# EAGLE design untitled (EAGLE 7.1.0)
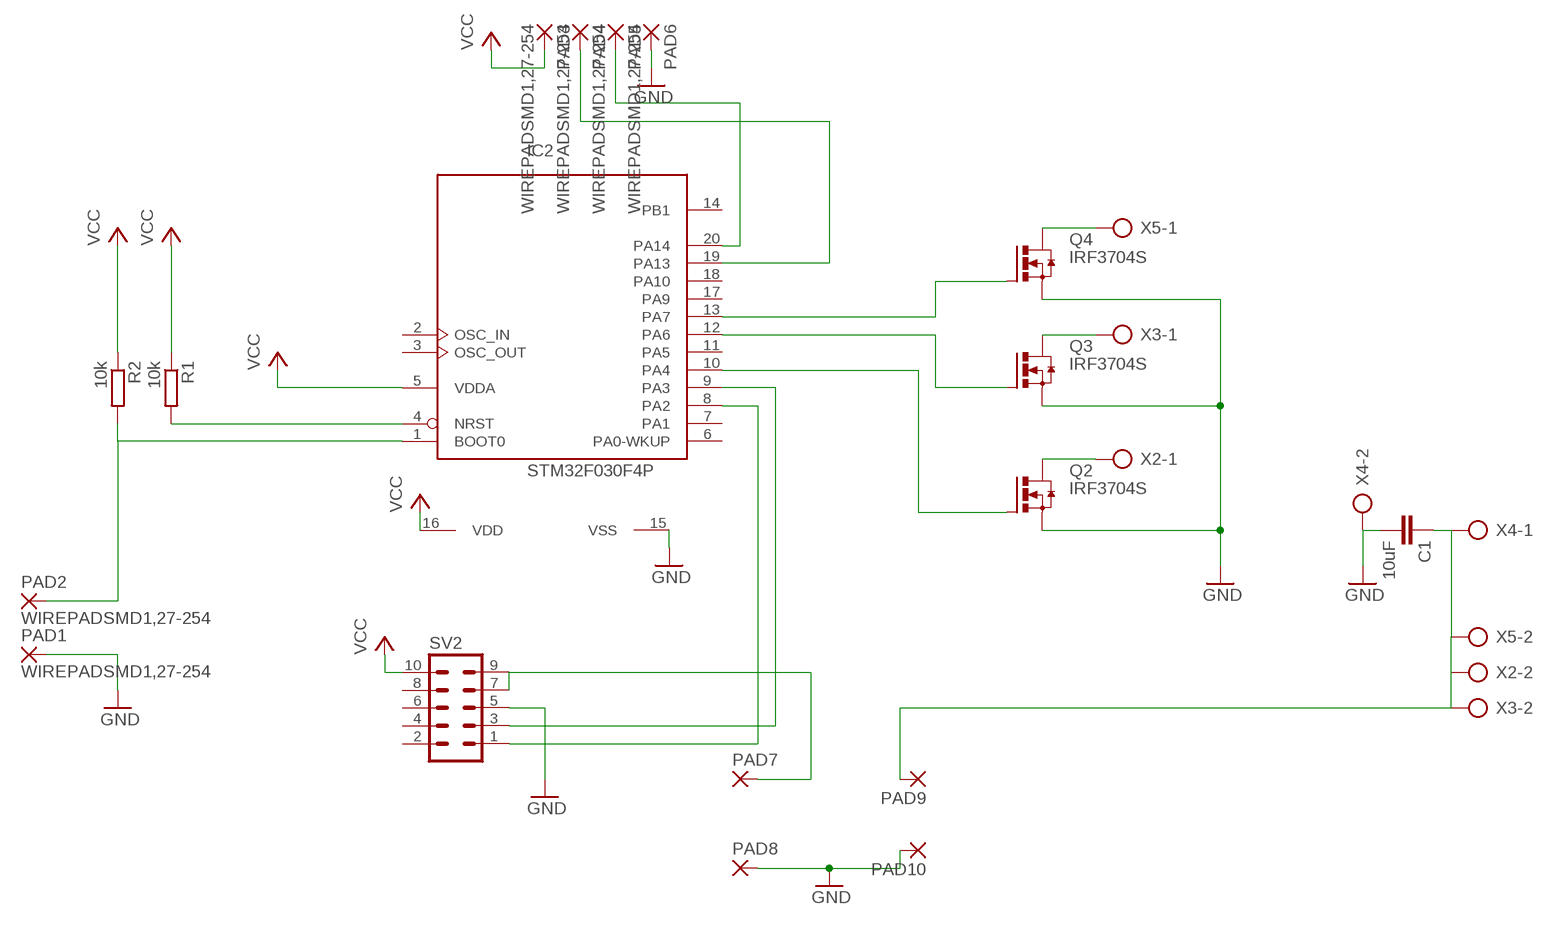
[diagram p0: schematic, sheet 1]

## Parts
C1  10uF  C-EU025-050X050  [C025-050X050]
IC2  STM32F030F4P  [TSSOP20-I]
PAD1  WIREPADSMD1,27-254  [SMD1,27-2,54]
PAD2  WIREPADSMD1,27-254  [SMD1,27-2,54]
PAD3  WIREPADSMD1,27-254  [SMD1,27-2,54]
PAD4  WIREPADSMD1,27-254  [SMD1,27-2,54]
PAD5  WIREPADSMD1,27-254  [SMD1,27-2,54]
PAD6  WIREPADSMD1,27-254  [SMD1,27-2,54]
PAD7  SMD5  [SMD2,54-5,08]
PAD8  SMD5  [SMD2,54-5,08]
PAD9  SMD5  [SMD2,54-5,08]
PAD10  SMD5  [SMD2,54-5,08]
Q2  IRF3704S  [D2PACK]
Q3  IRF3704S  [D2PACK]
Q4  IRF3704S  [D2PACK]
R1  10k  R-EU_R1206  [R1206]
R2  10k  R-EU_R1206  [R1206]
SV2  MA05-2  [MA05-2]
X2  AK500/2  [AK500/2]
X3  AK500/2  [AK500/2]
X4  AK500/2  [AK500/2]
X5  AK500/2  [AK500/2]

## Nets
GND: C1.2 IC2.15(VSS) PAD1.1(P) PAD6.1(P) PAD8.1(P) PAD10.1(P) Q2.3(S) Q3.3(S) Q4.3(S) SV2.5 X4.2
N$1: PAD7.1(P) SV2.7 SV2.9
N$6: IC2.8(PA2) SV2.1
N$7: C1.1 PAD9.1(P) X2.2 X3.2 X4.1 X5.2
N$9: IC2.9(PA3) SV2.3
N$10: Q4.2(D) X5.1
N$12: IC2.20(PA14) PAD5.1(P)
N$14: IC2.13(PA7) Q4.1(G)
N$15: IC2.10(PA4) Q2.1(G)
N$18: IC2.12(PA6) Q3.1(G)
N$20: IC2.19(PA13) PAD4.1(P)
N$21: Q2.2(D) X2.1
N$22: IC2.4(NRST) R1.2
N$23: IC2.1(BOOT0) PAD2.1(P) R2.2
N$28: Q3.2(D) X3.1
VCC: IC2.5(VDDA) IC2.16(VDD) PAD3.1(P) R1.1 R2.1 SV2.10
Unconnected: IC2.2(OSC_IN) IC2.3(OSC_OUT) IC2.6(PA0-WKUP) IC2.7(PA1) IC2.11(PA5) IC2.14(PB1) IC2.17(PA9) IC2.18(PA10) SV2.2 SV2.4 SV2.6 SV2.8

## Library data of the parts
C1 = rcl:C-EU: CAPACITOR, European symbol
IC2 = micro-stm_v2:STM32F030F*P: ARM 32-bit Cortex™-M0 CPU 48 MHz maximum frequency 16 Kbytes of Flash memory 4 kbytes of SRAM 15 GPIOs 2.4 to 3.6 V application supply
PAD1-PAD6 = wirepad:WIREPAD: Wire PAD connect wire on PCB
PAD7-PAD10 = wirepad:SMD5: SMD PAD
Q2-Q4 = transistor-power:IRF3704: SMPS MOSFET HEXFET® Power MOSFET Source: http://www.irf.com/product-info/datasheets/data/irf3704.pdf
R1 R2 = rcl:R-EU_: RESISTOR, European symbol
SV2 = con-lstb:MA05-2: PIN HEADER; OC_FARNELL: unknown; OC_NEWARK: unknown
X2-X5 = con-ptr500:AK500/2: CONNECTOR; OC_FARNELL: unknown; OC_NEWARK: unknown

## Board
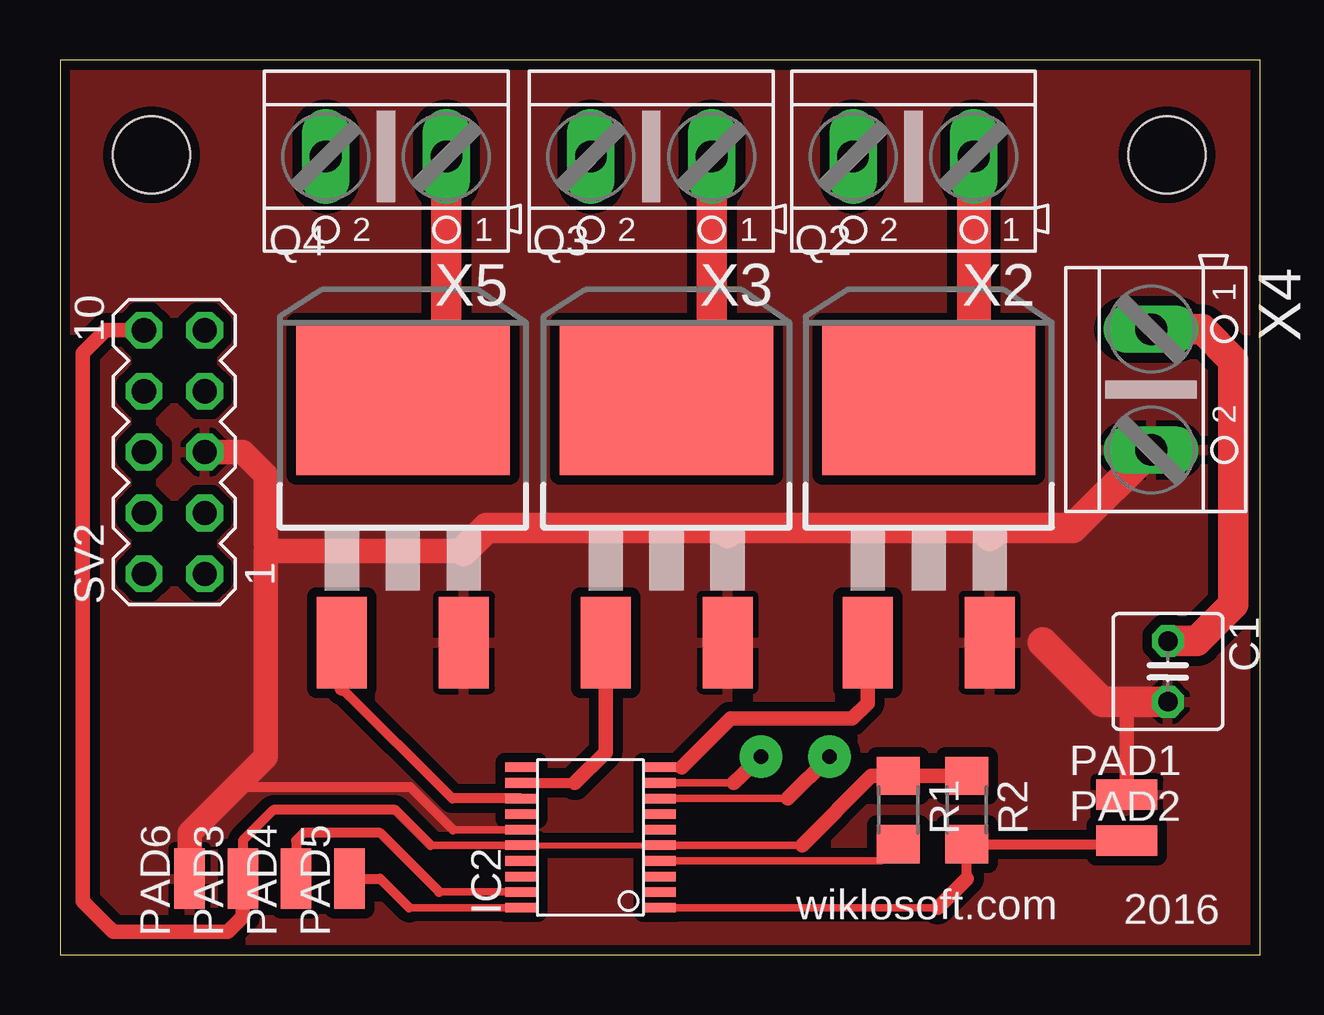
[diagram p1: board, top side]
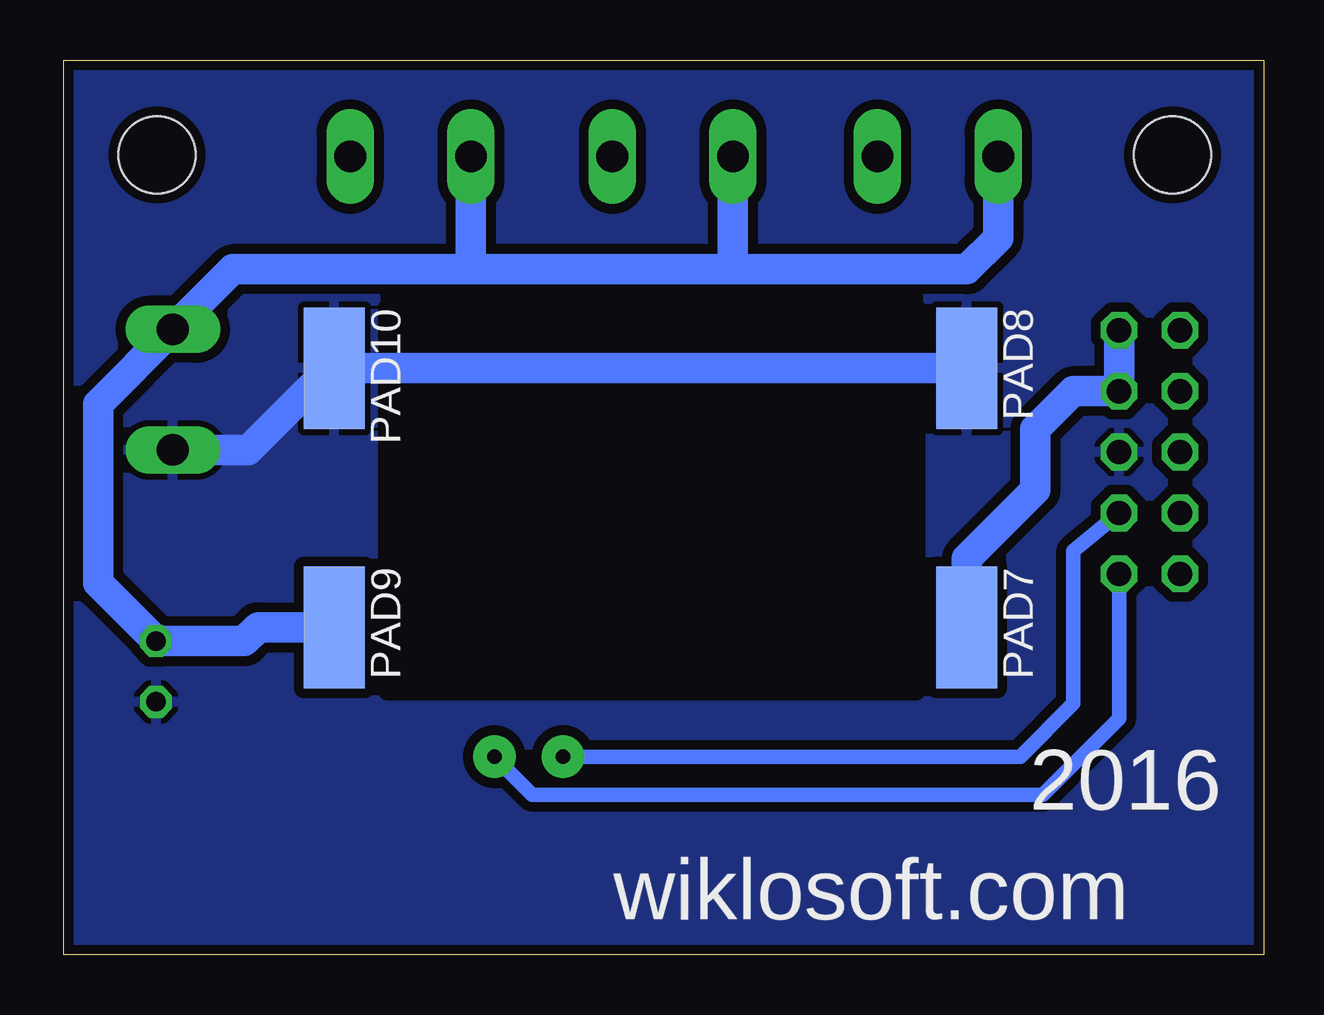
[diagram p2: board, bottom side, seen from below]

Size 50 x 37.3 mm. Coordinates in mm from the lower left corner, seen from the top.
Outline: 0,0 50,0 50,37.3 0,37.3 0,0
Copper layers (1*16): Top 0.035mm / dielectric 1.5mm / Bottom 0.035mm
Design rules "SeeedStudio_2layer_DRU_no_angle_20140221": minimum track width 6mil, minimum drill 12mil, track to track 6mil, track to pad 6mil, pad to pad 6mil, via to via 6mil, smd to smd 0mil, copper to edge 10mil, drill to drill 10mil, minimum pad ring 10mil, minimum via ring 6mil, stop-mask expansion 2mil, vias tented up to drill 100mil, thermal gap 10mil
Holes 3.2 mm at 46.13,33.34 3.81,33.34
bRestrict: area 14.5,11 to 36.5,27

### Footprints (pad centres in the part's own frame; a part is rotated, then mirrored left to right if it is on the bottom)
C025-050X050 = drill 0.813 octagon: 1 -1.27,0; 2 1.27,0
TSSOP20-I = smd 0.4 x 1.35: 1 -2.925,-2.875; 2 -2.275,-2.875; 3 -1.625,-2.875; 4 -0.975,-2.875; 5 -0.325,-2.875; 6 0.325,-2.875; 7 0.975,-2.875; 8 1.625,-2.875; 9 2.275,-2.875; 10 2.925,-2.875; 11 2.925,2.875; 12 2.275,2.875; 13 1.625,2.875; 14 0.975,2.875; 15 0.325,2.875; 16 -0.325,2.875; 17 -0.975,2.875; 18 -1.625,2.875; 19 -2.275,2.875; 20 -2.925,2.875
SMD1,27-2,54 = smd 1.27 x 2.54: 1 0,0
SMD2,54-5,08 = smd 2.54 x 5.08: 1 0,0
D2PACK = smd 2.083 x 3.81: 1 -2.54,-8.89; 3 2.54,-8.89 | smd 8.89 x 6.35: 2 0,1.27
R1206 = smd 1.6 x 1.803: 1 -1.422,0; 2 1.422,0
MA05-2 = drill 1.016 octagon: 1 -5.08,-1.27; 2 -5.08,1.27; 3 -2.54,-1.27; 4 -2.54,1.27; 5 0,-1.27; 6 0,1.27; 7 2.54,-1.27; 8 2.54,1.27; 9 5.08,-1.27; 10 5.08,1.27
AK500/2 = drill 1.321 long: 1 -2.515,0; 2 2.515,0

### Placement (x,y rotation side)
C1  46.16,11.81 270 top
IC2  22.1,4.89 90 top
PAD1  44.45,6.67 270 top
PAD2  44.45,4.76 270 top
PAD3  7.62,3.18 0 top
PAD4  9.84,3.18 0 top
PAD5  12.06,3.18 0 top
PAD6  5.4,3.18 0 top
PAD7  12.38,13.65 180 bottom
PAD8  12.38,24.45 180 bottom
PAD9  38.73,13.65 180 bottom
PAD10  38.73,24.45 180 bottom
Q2  36.2,21.91 0 top
Q3  25.27,21.91 0 top
Q4  14.29,21.91 0 top
R1  34.92,6.03 270 top
R2  37.78,6.03 270 top
SV2  4.76,20.96 90 top
X2  35.56,33.27 180 top
X3  24.64,33.27 180 top
X4  45.47,23.56 270 top
X5  13.59,33.27 180 top

### Tracks (layer width: path | path; a pad name or v marks a point on that pad's centre or on a via)
GND
  Top 0.305: IC2.15 16.38,5.21 | 8.57,17.14 8.57,16.83
  Top 0.406: 16.38,5.21 14.61,6.98 7.3,6.98
  Top 0.61: PAD1.1 44.45,10.54
  Top 1.016: SV2.5 7.62,20.96 8.57,20 8.57,17.14 | 16.83,16.83 8.57,16.83 8.57,8.25 7.3,6.98 5.4,5.08 PAD6.1
  Top 1.27: 16.83,16.83 17.78,17.78 27.62,17.78 | 27.62,17.78 39.05,17.78 | 39.05,17.78 42.2,17.78 X4.2 | 27.81,17.59 27.62,17.78 | 38.73,17.46 39.05,17.78 | C1.2 44.45,10.54 43.43,10.54 40.96,13.02
  Bottom 1.27: X4.2 42.32,21.04 38.91,24.45 PAD10.1 PAD8.1
  pour Bottom (isolate 0.406): 0,37.15 50.16,37.15 50.16,0 0,0
  pour Top (isolate 0.406): 0,37.15 49.85,37.15 49.85,0 0,0
N$1
  Bottom 1.27: SV2.9 SV2.7 7.94,23.5 9.53,21.91 9.53,19.37 12.38,16.51 PAD7.1 | PAD7.1 12.38,13.34 12.7,13.02 12.7,13.34 PAD7.1
N$6  (via drill 0.6 pad 1.78)
  Top 0.305: IC2.8 30.33,6.52
  Top 0.61: 30.33,6.52 v32.07,8.25
  Bottom 0.61: SV2.1 6.03,9.84 9.21,6.67 30.48,6.67 v32.07,8.25
N$7
  Top 0.305: X5.2 11.07,32.64
  Top 1.27: C1.1 47.37,13.08 48.9,14.61 48.9,24.77 47.59,26.07 X4.1
  Bottom 1.27: X5.2 11.07,29.88 12.38,28.57 21.91,28.57 | 21.91,28.57 33.02,28.57 | 33.02,28.57 42.96,28.57 X4.1 48.58,22.96 48.58,15.49 C1.1 42.48,13.08 41.91,13.65 PAD9.1 | X3.2 22.12,28.79 21.91,28.57 | X2.2 33.05,28.6 33.02,28.57
N$9  (via drill 0.6 pad 1.78)
  Top 0.305: IC2.9 28.08,7.16
  Top 0.61: 28.08,7.16 v29.21,8.25
  Bottom 0.61: v29.21,8.25 10.16,8.25 7.94,10.48 7.94,16.83 SV2.3
N$10
  Top 1.27: X5.1 16.1,22.49 15.78,22.17
  Top 1.422: 15.88,22.54 15.78,22.17 Q4.2
N$12
  Top 0.305: IC2.20 14.55,1.96
  Top 0.406: PAD5.1 13.34,3.18 14.55,1.96
N$14
  Top 0.406: IC2.13 16.35,6.52 11.75,11.11
  Top 0.61: 11.75,11.11 Q4.1
N$15
  Top 0.305: IC2.10 25.91,7.82
  Top 0.61: 25.91,7.82 27.94,9.84 33.02,9.84 33.66,10.48 Q2.1
N$18
  Top 0.406: IC2.12 21.45,7.16
  Top 0.61: 21.45,7.16 22.73,8.45 Q3.1
N$20
  Top 0.305: IC2.19 15.8,2.62
  Top 0.406: 15.8,2.62 13.34,5.08 10.16,5.08 9.84,4.76 PAD4.1
N$21
  Top 1.422: X2.1 38.08,27.28 38.1,21.59 Q2.2
N$22
  Top 0.305: IC2.4 34.23,3.91 R1.2
N$23
  Top 0.305: 44.3,4.61 PAD2.1 | IC2.1 36.57,1.96
  Top 0.406: 37.78,3.18 R2.2 44.45,4.61 PAD2.1
  Top 0.61: 36.57,1.96 37.78,3.18
N$28
  Top 1.27: X3.1 27.15,22.9 27.1,22.84
  Top 1.422: Q3.2 27.1,22.84 27.18,23.37
VCC
  Top 0.254: IC2.16 IC2.5
  Top 0.305: IC2.16 15.44,4.57 | IC2.5 30.92,4.57
  Top 0.406: 15.44,4.57 13.97,6.03 8.89,6.03 7.62,4.76 PAD3.1
  Top 0.61: SV2.10 1.91,26.04 0.95,25.08 0.95,2.22 2.22,0.95 6.99,0.95 7.62,1.59 PAD3.1 | R2.1 R1.1 33.81,7.45 30.92,4.57

### Text on the board
tNames: wiklosoft.com | 2016
bNames: 2016 | wiklosoft.com